# Altium schematic sheet Main.SchDoc
size A3; SheetNumber: 1; SheetTotal: 2
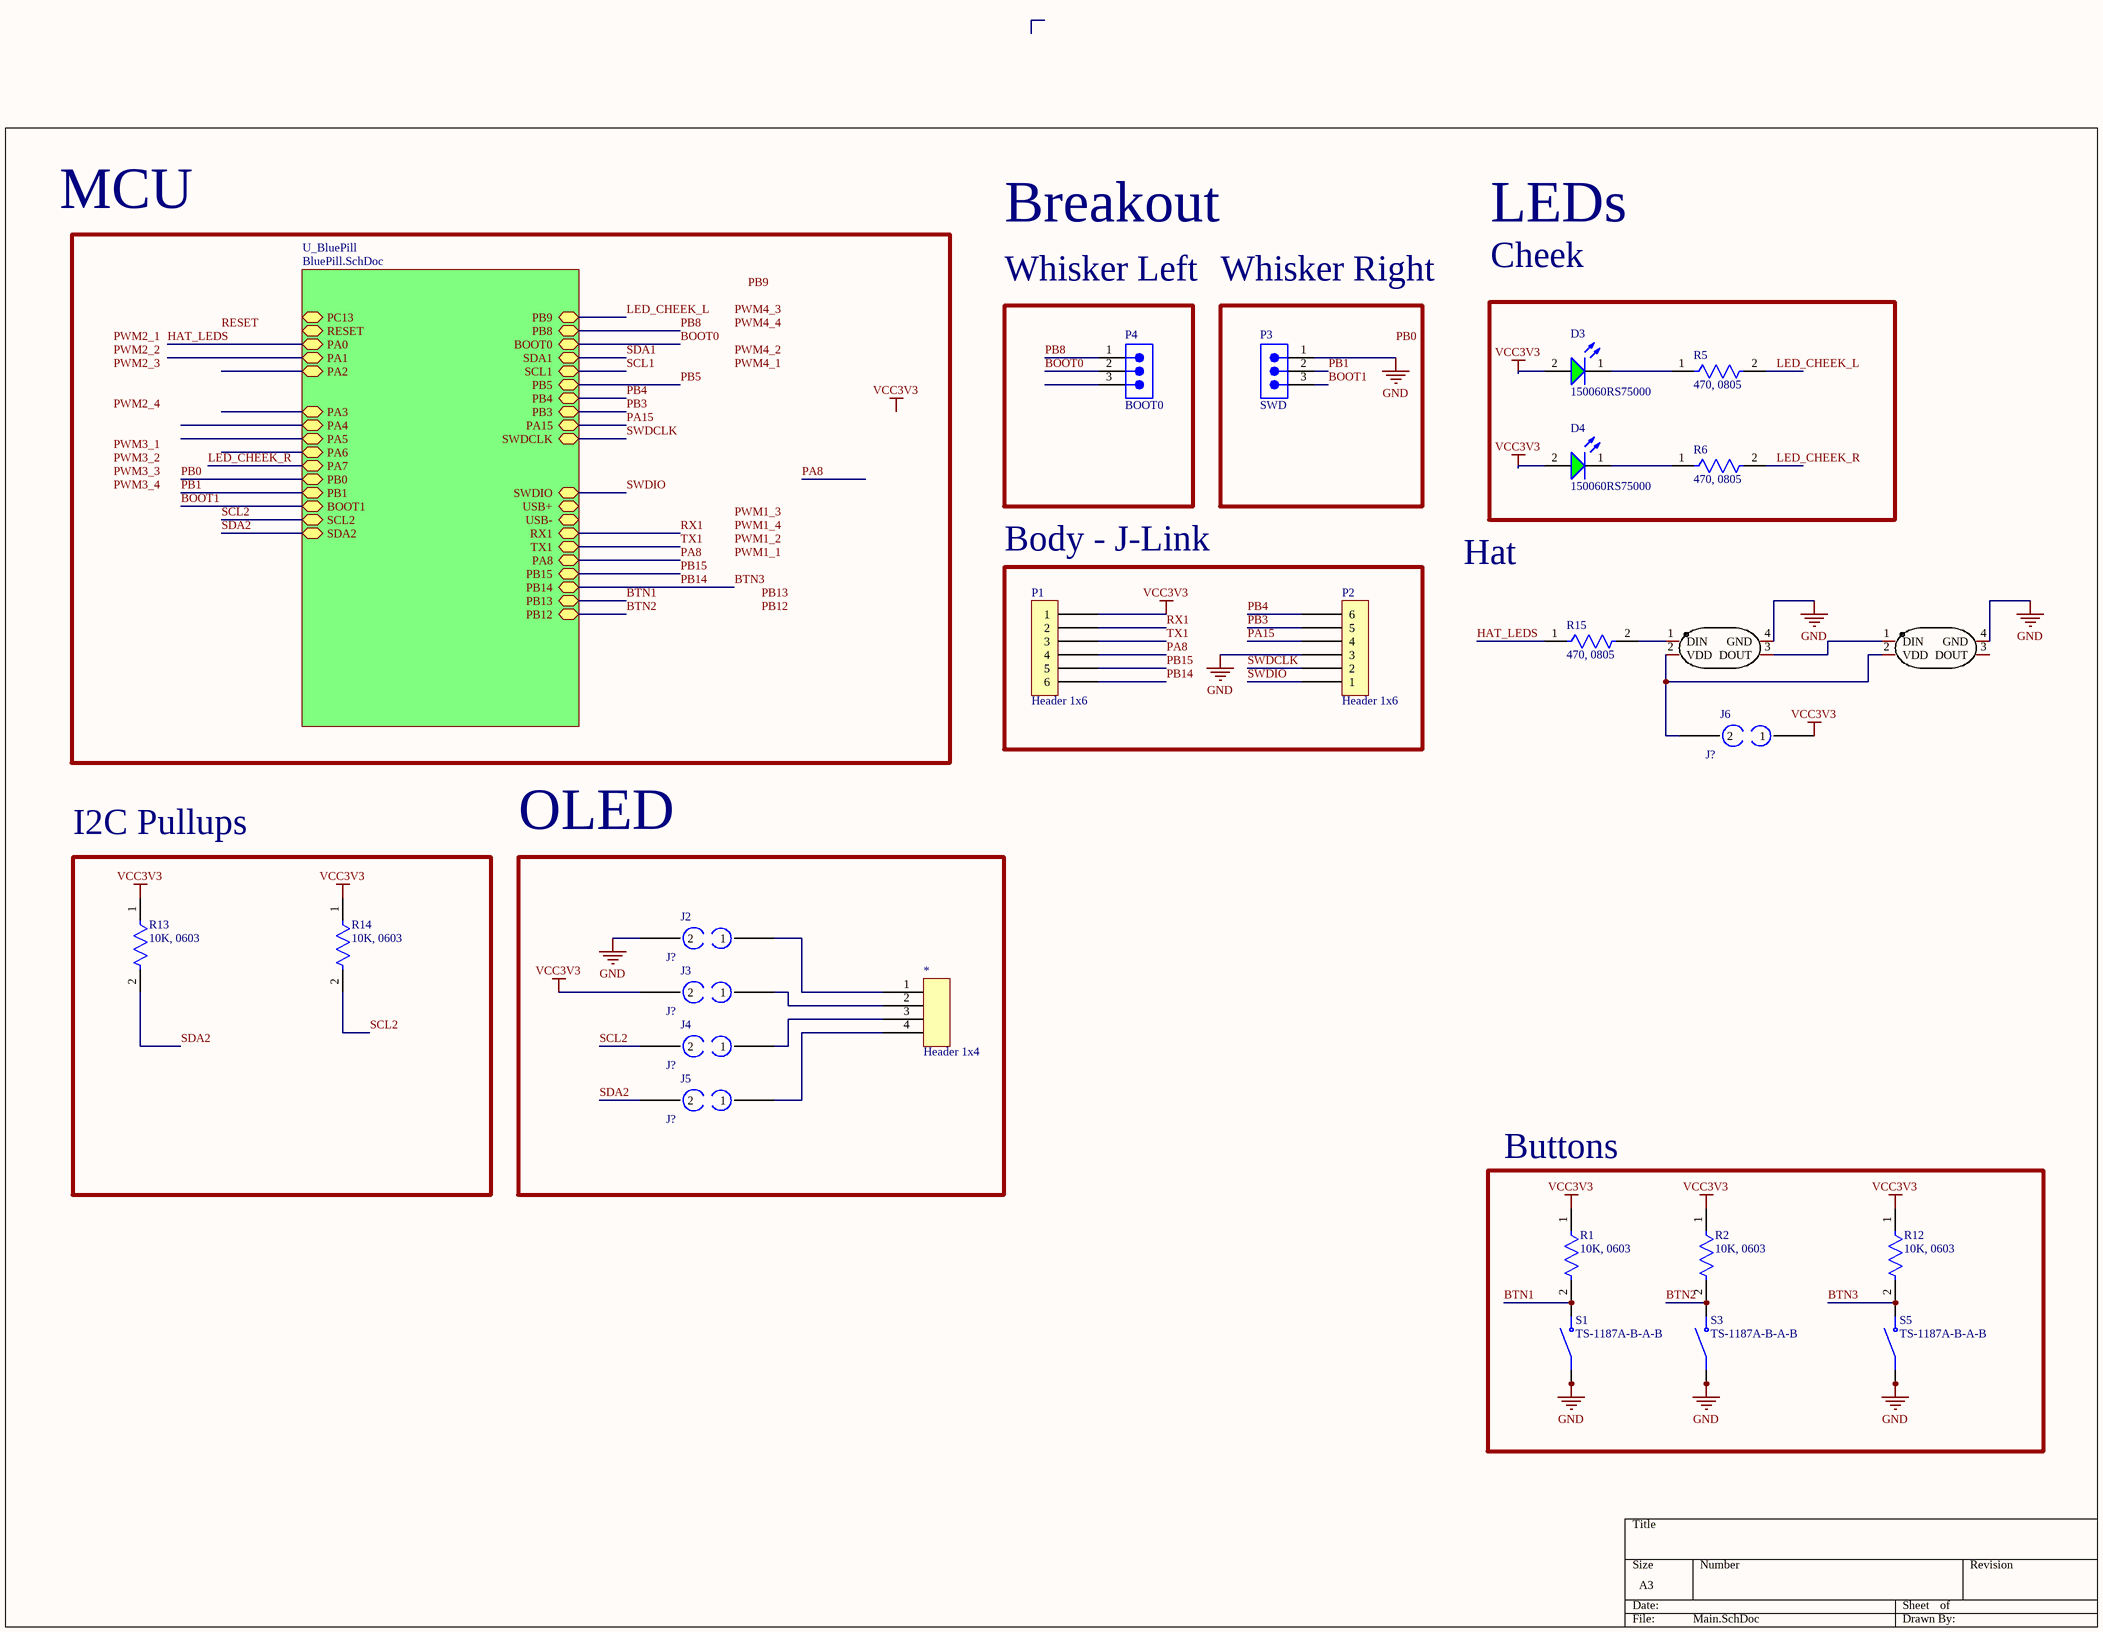
[diagram p0: Main.SchDoc]

## Parts
*  Header 1x4  [Header 1x4]
D3  150060RS75000  [WL-SMCW_0805_150080xx75000]
D4  150060RS75000  [WL-SMCW_0805_150080xx75000]
J2  J?  [SOLDER_BRIDGE_OPEN]
J3  J?  [SOLDER_BRIDGE_OPEN]
J4  J?  [SOLDER_BRIDGE_OPEN]
J5  J?  [SOLDER_BRIDGE_OPEN]
J6  J?  [SOLDER_BRIDGE_OPEN]
LED1  SK6812SIDE-A-RVS  [LED-SMD_4P-L4.0-W1.6-L]  (value not drawn)
LED2  SK6812SIDE-A-RVS  [LED-SMD_4P-L4.0-W1.6-L]  (value not drawn)
P1  Header 1x6  [1x6_debug]
P2  Header 1x6  [1x6_debug]
P3  SWD  [61300311121]
P4  BOOT0  [61300311121]
R1  10K, 0603  [FP-RC0603-0_55-IPC_C]
R2  10K, 0603  [FP-RC0603-0_55-IPC_C]
R5  470, 0805  [FP-RT0805-MFG]
R6  470, 0805  [FP-RT0805-MFG]
R12  10K, 0603  [FP-RC0603-0_55-IPC_C]
R13  10K, 0603  [FP-RC0603-0_55-IPC_C]
R14  10K, 0603  [FP-RC0603-0_55-IPC_C]
R15  470, 0805  [FP-RT0805-MFG]
S1  TS-1187A-B-A-B  [SW_TS-1187A-B-A-B]
S3  TS-1187A-B-A-B  [SW_TS-1187A-B-A-B]
S5  TS-1187A-B-A-B  [SW_TS-1187A-B-A-B]

## Blocks framed on the sheet
Whisker Left: P4
Whisker Right: P3
Body - J-Link: P1 P2
I2C Pullups: R13 R14
OLED: * J2-J5
Buttons: R1 R2 R12 S1 S3 S5

## Sub-sheets
U_BluePill = BluePill.SchDoc: PA0 (bidir), PA1 (bidir), PA2 (bidir), PA3 (bidir), PA8 (bidir), TX1 (bidir), RX1 (bidir), SWDIO (bidir), SWDCLK (bidir), PA15 (bidir), PC13 (bidir), PB0 (bidir), PB1 (bidir), BOOT1 (bidir), PB3 (bidir), PB4 (bidir), PB5 (bidir), SCL1 (bidir), SDA1 (bidir), PB8 (bidir), PB9 (bidir), SCL2 (bidir), SDA2 (bidir), BOOT0 (bidir), RESET (bidir), USB- (bidir), USB+ (bidir), PA4 (bidir), PA5 (bidir), PA6 (bidir), PA7 (bidir), PB12 (bidir), PB13 (bidir), PB14 (bidir), PB15 (bidir)

## Nets
GND: J2.2 LED1.4(GND) LED2.4(GND) P2.3 P3.1 S1.A(COM) S1.B(COM) S3.A(COM) S3.B(COM) S5.A(COM) S5.B(COM)
VCC3V3: D3.2(A) D4.2(A) J3.2 J6.1 P1.1 R1.1 R2.1 R12.1 R13.1 R14.1
BOOT0: P4.2 ; sheet U_BluePill/BOOT0
BOOT1: P3.3 ; sheet U_BluePill/BOOT1
BTN1: R1.2 S1.C(NO) S1.D(NO) ; sheet U_BluePill/PB13
BTN2: R2.2 S3.C(NO) S3.D(NO) ; sheet U_BluePill/PB12
BTN3: P1.6 R12.2 S5.C(NO) S5.D(NO) ; sheet U_BluePill/PB14  [also labelled PB14]
HAT_LEDS: R15.1 ; sheet U_BluePill/PA0
LED_CHEEK_L: R5.2 ; sheet U_BluePill/PB9
LED_CHEEK_R: R6.2 ; sheet U_BluePill/PA7
PA8: P1.4 ; sheet U_BluePill/PA8
PA15: P2.4 ; sheet U_BluePill/PA15
PB0: sheet U_BluePill/PB0
PB1: P3.2 ; sheet U_BluePill/PB1
PB3: P2.5 ; sheet U_BluePill/PB3
PB4: P2.6 ; sheet U_BluePill/PB4
PB5: sheet U_BluePill/PB5
PB8: P4.1 ; sheet U_BluePill/PB8
PB15: P1.5 ; sheet U_BluePill/PB15
RX1: P1.2 ; sheet U_BluePill/RX1
SCL1: sheet U_BluePill/SCL1
SCL2: J4.2 R14.2 ; sheet U_BluePill/SCL2
SDA1: sheet U_BluePill/SDA1
SDA2: J5.2 R13.2 ; sheet U_BluePill/SDA2
SWDCLK: P2.2 ; sheet U_BluePill/SWDCLK
SWDIO: P2.1 ; sheet U_BluePill/SWDIO
TX1: P1.3 ; sheet U_BluePill/TX1
Net*_1: *.1 J2.1
Net*_2: *.2 J3.1
Net*_3: *.3 J4.1
Net*_4: *.4 J5.1
NetD3_1: D3.1(K) R5.1
NetD4_1: D4.1(K) R6.1
NetJ6_2: J6.2 LED1.2(VDD) LED2.2(VDD)
NetLED1_1: LED1.1(DIN) R15.2
NetLED1_3: LED1.3(DOUT) LED2.1(DIN)

Not connected (* = marked no-connect by the designer): LED2 3(DOUT); P4 3

## Notes on the sheet
- MCU
- Breakout
- LEDs
- Cheek
- Hat
- Labels drawn without touching a wire or pin: PB0, PB9, PB12, PB13, PWM1_1, PWM1_2, PWM1_3, PWM1_4, PWM2_1, PWM2_2, PWM2_3, PWM2_4, PWM3_1, PWM3_2, PWM3_3, PWM3_4, PWM4_1, PWM4_2, PWM4_3, PWM4_4, RESET, VCC3V3

## Library data of the parts
D3 D4 = CMP-1426-00007-2: NexarPartId: 29717780; Wavelength: 520nm; Forward Current: 100mA; Lens Style: Clear, Rectangular; Dominant Wavelength: 525nm; Max Junction Temperature (Tj): 95°C; Power Dissipation: 105mW; Luminous Intensity: 450mcd; Peak Wavelength: 515nm; Color: Green; Viewing Angle: 140°; Test Current: 20mA; Reverse Voltage: 5V; Forward Voltage: 3.2V; Mount: Surface Mount; REACH SVHC: Unknown; Min Operating Temperature: -40°C; Case Code (Imperial): 0805; Case/Package: 0805; Max Operating Temperature: 85°C; RoHS: Compliant; Length: 2mm; Height: 700µm; Width: 1.25mm; Case Code (Metric): 2012; Packaging: Tape and Reel; Max Reverse Voltage (DC): 5V
J2-J6 = Solder-Bridge-OPEN
LED1 LED2 = SK6812SIDE-A-RVS: Manufacturer: 欧思科光电; Add into BOM: yes; Symbol: SK6812SIDE-A-RVS; Device: SK6812SIDE-A-RVS; LCSC Part Name: RGB三色; Supplier Part: C2890037; Manufacturer Part: SK6812SIDE-A-RVS; Supplier Footprint: SMD,2x4mm; JLCPCB Part Class: Extended Part; Datasheet: https://atta.szlcsc.com/upload/public/pdf/source/20210825/5EE39C41748E35606331A2C5A4C913B6.pdf; Supplier: LCSC; Convert to PCB: yes
P3 P4 = CMP-1502-01062-2: NexarPartId: 32855521; Voltage Rating: 250V; Current Rating: 3A; Connector Type: Male Pin; Number of Positions: 3; Gender: Male; Contact Resistance: 20mΩ; Pitch: 2.54mm; Max Operating Temperature: 105°C; Lead Pitch: 2.54mm; Lead Free: Lead Free; Contact Mating Length: 5.9944mm; Contact Material: Copper; Number of Pins: 3; Orientation: Vertical; Height: 8.94mm; Packaging: Bulk; Min Operating Temperature: -40°C; Mount: Through Hole; RoHS: Compliant; Number of Contacts: 3; Operating Supply Voltage: 250V; Termination: Solder; Number of Rows: 1; Contact Plating: Gold; Color: Black; REACH SVHC: Unknown
R1 R2 R12-R14 = CMP-2100-03664-2: RES 10K OHM 1% 1/10W 0603; Voltage Rating: 75V; Voltage Rating (DC): 50V; Resistance: 10kR; Power Rating: 100mW; Temperature Coefficient: 100ppm/°C; Depth: 0.8mm; Termination: SMD/SMT; Resistor Type: Thick Film; Series: RC; Construction: Rectangular; Features: Moisture Resistant; Packaging: Tape and Reel; Min Operating Temperature: -55°C; Number of Terminations: 2; Lead Pitch: 0.3mm; RoHS Compliant: Yes; Case/Package: 0603; Resistance Tolerance: 1%; Military Standard: Not; Weight: 7.1E-05oz; Number of Pins: 2; Tolerance: 1%; Length: 1.6mm; Case Code (Imperial): 0603; Lead Free: Lead Free; Width: 0.8mm; Max Power Dissipation: 100mW; Height: 0.45mm; Max Operating Temperature: 155°C; Case Code (Metric): 1608; Size Code: 0603
R5 R6 R15 = CMP-03412-031818-1: RES SMD 470 OHM 1% 1/8W 0805; Manufacturer Part Number: RT0805FRE07470RL; Manufacturer: Yageo; Temperature Coefficient: 50 ppm/°C; Value: 470Ω; Tolerance: 0.0001; Voltage Rating: 150V; Power Rating: 0.125W; Automotive: No; Device Class L2: Resistors; Lead Free: Yes; Digikey Description: RES SMD 470 OHM 1% 1/8W 0805; Category: Res; Package: RT0805; ComponentLink2Description: Datasheet; Ipc Land Pattern Name: RESC200125X50; Resistance: 470Ω; Octopart: https://octopart.com/rt0805fre07470rl-yageo-39983328; Height: 0.6mm; Temperature Range High: +155°C; Composition: Thin Film; Footprint Url: http://www.yageo.com/exep/pages/download/literatures/PYu-R_Mount_10.pdf; Device Class L1: Passive Components; Temperature Range Low: -55°C; Temperature: -55°C to +155°C; RoHS: TRUE; ComponentLink2URL: http://www.yageo.com/documents/recent/PYu-RT_1-to-0.01_RoHS_L_9.pdf; Mouser Description: High Precision-High Stability Chip Resistor Thin Film 0805 470Ohm 1% Paper T/R; Device Class L3: Chip SMD Resistors; Series: RT
S1 S3 S5 = CMP-033-000000-1: SPST 50mA @ 12VDC Top Actuated Round Button 160gf SMD Tactile Switches RoHS; MP: TS-1187A-B-A-B; Value: *; Design Item ID: TS-1187A-B-A-B; Availability: Unavailable; Package: None; Price: None; Component Type: Standard; Pin Count: 4; Source: TS-1187A-B-A-B.SchLib